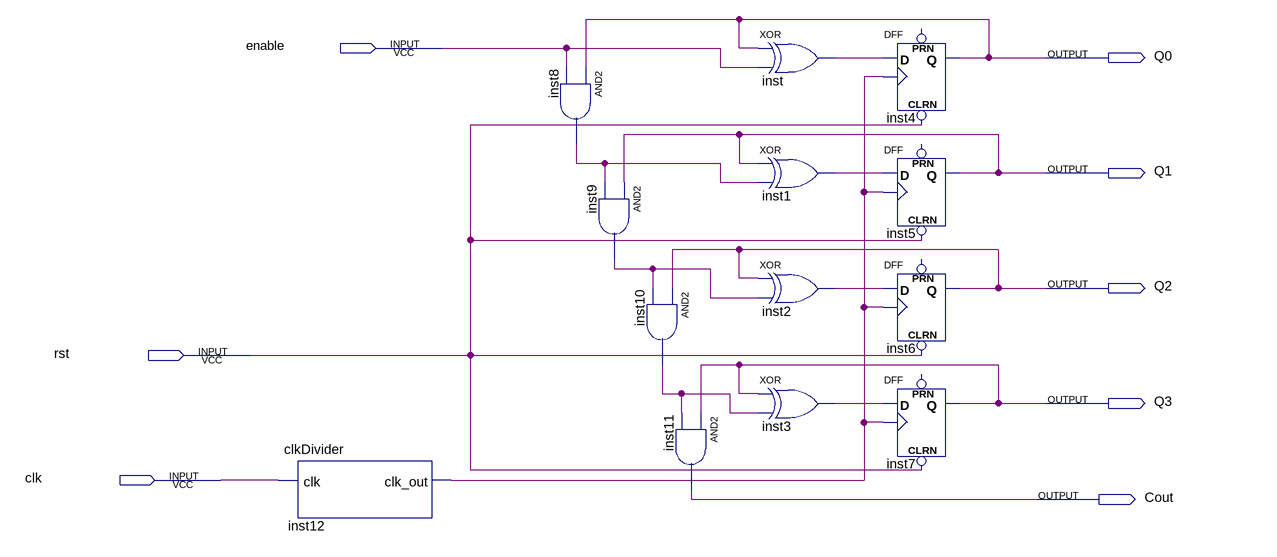
[diagram p0: schematic sheet]
// Quartus schematic shematicEntrySynUpCounter.bdf as structural Verilog: 13 symbols, 8 pins
module shematicEntrySynUpCounter (
  input  enable,
  input  rst,
  input  clk,
  output Q0,
  output Q1,
  output Q2,
  output Q3,
  output Cout
);

  wire inst1_out, inst2_out, inst3_out, inst8_out, inst9_out, inst10_out, inst12_clk_out, inst_out;

  clkDivider inst12 (.clk(clk), .clk_out(inst12_clk_out));
  and inst8 (inst8_out, Q0, enable);
  and inst9 (inst9_out, Q1, inst8_out);
  and inst10 (inst10_out, Q2, inst9_out);
  and inst11 (Cout, Q3, inst10_out);
  xor inst (inst_out, Q0, enable);
  xor inst1 (inst1_out, Q1, inst8_out);
  xor inst2 (inst2_out, Q2, inst9_out);
  xor inst3 (inst3_out, Q3, inst10_out);
  DFF inst4 (.CLRN(rst), .CLK(inst12_clk_out), .D(inst_out), .Q(Q0));  // open: PRN
  DFF inst5 (.CLRN(rst), .CLK(inst12_clk_out), .D(inst1_out), .Q(Q1));  // open: PRN
  DFF inst6 (.CLRN(rst), .CLK(inst12_clk_out), .D(inst2_out), .Q(Q2));  // open: PRN
  DFF inst7 (.CLRN(rst), .CLK(inst12_clk_out), .D(inst3_out), .Q(Q3));  // open: PRN
endmodule
